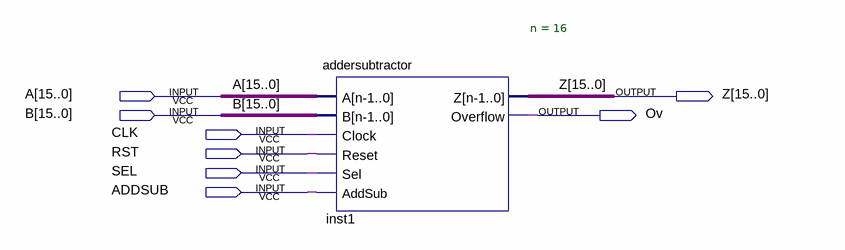
[diagram p0: schematic sheet]
// Quartus schematic Library_Module.bdf as structural Verilog: 1 symbols, 8 pins
module Library_Module (
  input  [15:0] A,
  input  [15:0] B,
  input  CLK,
  input  RST,
  input  SEL,
  input  ADDSUB,
  output [15:0] Z,
  output Ov
);

  addersubtractor #(.n(16)) inst1 (
    .A(A), .B(B), .Clock(CLK), .Reset(RST), .Sel(SEL), .AddSub(ADDSUB), .Z(Z), .Overflow(Ov));
endmodule
